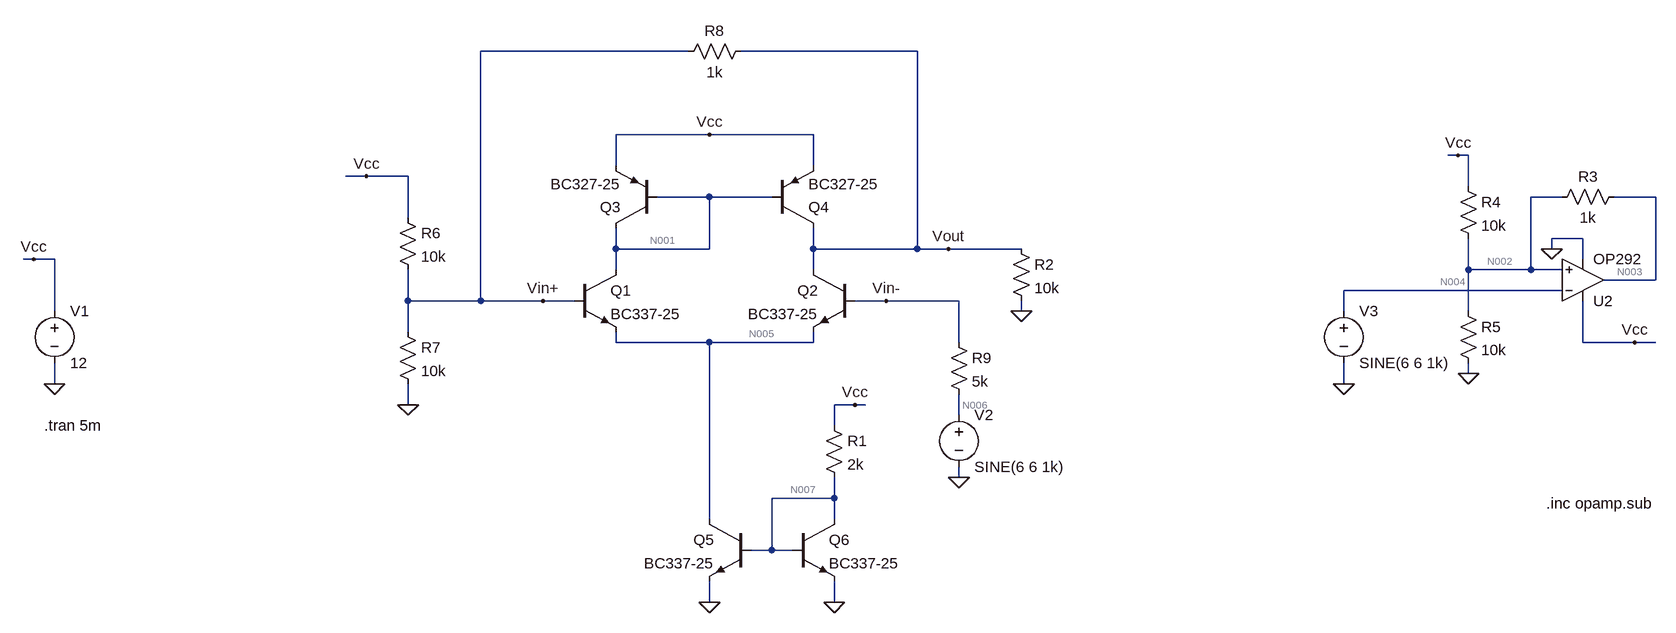
[diagram p0: schematic hysteresis_comparator.asc]
hysteresis_comparator.asc, the LTspice schematic file:
Version 4
SHEET 1 1888 708
WIRE 272 -160 -48 -160
WIRE 624 -160 352 -160
WIRE 304 -32 160 -32
WIRE 464 -32 304 -32
WIRE 1456 0 1440 0
WIRE 1472 0 1456 0
WIRE 160 16 160 -32
WIRE 464 16 464 -32
WIRE -224 32 -256 32
WIRE -160 32 -224 32
WIRE 1472 48 1472 0
WIRE 304 64 224 64
WIRE 400 64 304 64
WIRE 1616 64 1568 64
WIRE 1760 64 1696 64
WIRE -160 96 -160 32
WIRE 1648 128 1600 128
WIRE 160 144 160 112
WIRE 304 144 304 64
WIRE 304 144 160 144
WIRE 464 144 464 112
WIRE 624 144 624 -160
WIRE 624 144 464 144
WIRE 672 144 624 144
WIRE 784 144 672 144
WIRE 1600 144 1600 128
WIRE -736 160 -752 160
WIRE -704 160 -736 160
WIRE 1648 160 1648 128
WIRE 160 176 160 144
WIRE 464 176 464 144
WIRE 1472 176 1472 128
WIRE 1568 176 1568 64
WIRE 1568 176 1472 176
WIRE 1616 176 1568 176
WIRE 1760 192 1760 64
WIRE 1760 192 1680 192
WIRE 1616 208 1280 208
WIRE -160 224 -160 176
WIRE -48 224 -48 -160
WIRE -48 224 -160 224
WIRE 48 224 -48 224
WIRE 96 224 48 224
WIRE 576 224 528 224
WIRE 688 224 576 224
WIRE -704 240 -704 160
WIRE 784 240 784 224
WIRE 1280 240 1280 208
WIRE 1472 240 1472 176
WIRE -160 272 -160 224
WIRE 160 288 160 272
WIRE 304 288 160 288
WIRE 464 288 464 272
WIRE 464 288 304 288
WIRE 688 288 688 224
WIRE 1648 288 1648 224
WIRE 1728 288 1648 288
WIRE 1760 288 1728 288
WIRE 1472 336 1472 320
WIRE -704 352 -704 320
WIRE 1280 352 1280 320
WIRE -160 384 -160 352
WIRE 528 384 496 384
WIRE 544 384 528 384
WIRE 688 400 688 368
WIRE 496 416 496 384
WIRE 688 496 688 480
WIRE 496 528 496 496
WIRE 496 528 400 528
WIRE 304 560 304 288
WIRE 496 560 496 528
WIRE 400 608 400 528
WIRE 400 608 368 608
WIRE 432 608 400 608
WIRE 304 688 304 656
WIRE 496 688 496 656
FLAG -704 352 0
FLAG -736 160 Vcc
FLAG 304 -32 Vcc
FLAG 672 144 Vout
FLAG 784 240 0
FLAG 304 688 0
FLAG 496 688 0
FLAG 528 384 Vcc
FLAG 1472 336 0
FLAG 1456 0 Vcc
FLAG 1280 352 0
FLAG 1600 144 0
FLAG 1728 288 Vcc
FLAG 48 224 Vin+
FLAG 576 224 Vin-
FLAG 688 496 0
FLAG -160 384 0
FLAG -224 32 Vcc
SYMBOL npn 96 176 R0
SYMATTR InstName Q1
SYMATTR Value BC337-25
SYMBOL npn 528 176 M0
SYMATTR InstName Q2
SYMATTR Value BC337-25
SYMBOL pnp 224 112 R180
SYMATTR InstName Q3
SYMATTR Value BC327-25
SYMBOL pnp 400 112 M180
SYMATTR InstName Q4
SYMATTR Value BC327-25
SYMBOL voltage -704 224 R0
SYMATTR InstName V1
SYMATTR Value 12
SYMBOL res 768 128 R0
SYMATTR InstName R2
SYMATTR Value 10k
SYMBOL npn 368 560 M0
SYMATTR InstName Q5
SYMATTR Value BC337-25
SYMBOL npn 432 560 R0
SYMATTR InstName Q6
SYMATTR Value BC337-25
SYMBOL res 480 400 R0
SYMATTR InstName R1
SYMATTR Value 2k
SYMBOL res 1712 48 R90
WINDOW 0 0 56 VBottom 2
WINDOW 3 32 56 VTop 2
SYMATTR InstName R3
SYMATTR Value 1k
SYMBOL res 1456 32 R0
SYMATTR InstName R4
SYMATTR Value 10k
SYMBOL res 1456 224 R0
SYMATTR InstName R5
SYMATTR Value 10k
SYMBOL voltage 1280 224 R0
WINDOW 123 0 0 Left 0
WINDOW 39 0 0 Left 0
SYMATTR InstName V3
SYMATTR Value SINE(6 6 1k)
SYMBOL OpAmps\\OP292 1648 256 M180
SYMATTR InstName U2
SYMBOL voltage 688 384 R0
WINDOW 123 0 0 Left 0
WINDOW 39 0 0 Left 0
SYMATTR InstName V2
SYMATTR Value SINE(6 6 1k)
SYMBOL res -176 80 R0
SYMATTR InstName R6
SYMATTR Value 10k
SYMBOL res -176 256 R0
SYMATTR InstName R7
SYMATTR Value 10k
SYMBOL res 368 -176 R90
WINDOW 0 0 56 VBottom 2
WINDOW 3 32 56 VTop 2
SYMATTR InstName R8
SYMATTR Value 1k
SYMBOL res 672 272 R0
SYMATTR InstName R9
SYMATTR Value 5k
TEXT -720 416 Left 2 !.tran 5m
TEXT 1592 536 Left 2 !.inc opamp.sub

The netlist it stands for:
* hysteresis_comparator.asc
Q1 N001 Vin+ N005 0 BC337-25
Q2 Vout Vin- N005 0 BC337-25
Q3 N001 N001 Vcc 0 BC327-25
Q4 Vout N001 Vcc 0 BC327-25
V1 Vcc 0 12
R2 Vout 0 10k
Q5 N005 N007 0 0 BC337-25
Q6 N007 N007 0 0 BC337-25
R1 Vcc N007 2k
R3 N003 N002 1k
R4 Vcc N002 10k
R5 N002 0 10k
V3 N004 0 SINE(6 6 1k)
XU2 N002 N004 Vcc 0 N003 OP292  ; pins In+ In- V+ V- OUT
V2 N006 0 SINE(6 6 1k)
R6 Vcc Vin+ 10k
R7 Vin+ 0 10k
R8 Vout Vin+ 1k
R9 Vin- N006 5k
.model NPN NPN
.model PNP PNP
.lib standard.bjt
.tran 5m
.inc opamp.sub
.lib ADI1.lib
.backanno
.end

* Results of the author's LTspice run, read from the files saved beside the schematic
* Operating Point, zero values left out:
*   V(n001) = 11.38 V
*   V(vin+) = 5.948 V
*   V(n005) = 5.312 V
*   V(vout) = 5.948 V
*   V(vin-) = 5.948 V
*   V(vcc) = 12 V
*   V(n007) = 654 mV
*   V(n003) = 89.55 mV
*   V(n002) = 1.075 V
*   V(n004) = 6 V
*   V(n006) = 6 V
*   Ic(Q1) = 2.939 mA
*   Ib(Q1) = 10.31 µA
*   Ie(Q1) = -2.95 mA
*   Ic(Q2) = 2.853 mA
*   Ib(Q2) = 10.39 µA
*   Ie(Q2) = -2.864 mA
*   Ic(Q5) = 5.814 mA
*   Ib(Q5) = 20.48 µA
*   Ie(Q5) = -5.834 mA
*   Ic(Q6) = 5.632 mA
*   Ib(Q6) = 20.5 µA
*   Ie(Q6) = -5.652 mA
*   Ic(Q3) = -2.922 mA
*   Ib(Q3) = -8.745 µA
*   Ie(Q3) = 2.931 mA
*   Ic(Q4) = -3.448 mA
*   Ib(Q4) = -8.72 µA
*   Ie(Q4) = 3.457 mA
*   I(R2) = 594.8 µA
*   I(R1) = 5.673 mA
*   I(R3) = -985.7 µA
*   I(R4) = 1.092 mA
*   I(R5) = 107.5 µA
*   I(R6) = 605.2 µA
*   I(R7) = 594.8 µA
*   I(R8) = -123.8 nA
*   I(R9) = -10.39 µA
*   I(V1) = -14.5 mA
*   I(V3) = 9.99 nA
*   I(V2) = -10.39 µA
*   Ix(u2:2) = -790 nA
*   Ix(u2:1) = -9.99 nA
*   Ix(u2:99) = 746 µA
*   Ix(u2:50) = -1.71 mA
*   Ix(u2:34) = 985.7 µA
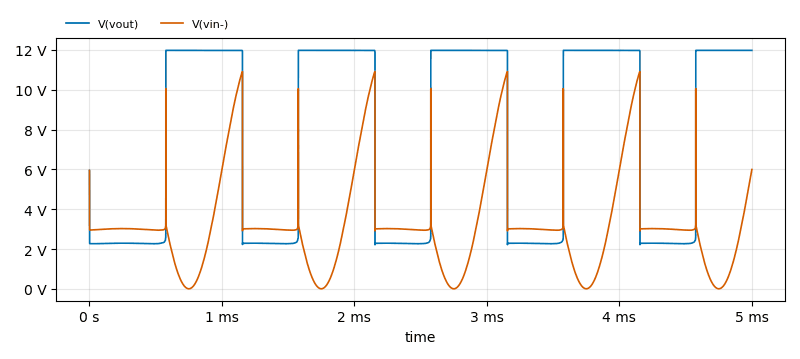
[diagram p1: Transient Analysis of hysteresis_comparator.asc, plotted from the saved traces]
* Transient Analysis, 1 run:
*   V(vout): min 2.214 V, max 11.98 V, average 7.597 V, rms 8.999 V, last 11.98 V
*   V(vin-): min 1.487 mV, max 10.92 V, average 3.176 V, rms 4.027 V, last 5.996 V